# EasyEDA schematic SCH_clock rev b_2022-04-02.json
TITLE: Sheet_1; REV: B; Date: 2022-03-05; Sheet: 1/1; Drawn By: ckscullion; Company: Your Company
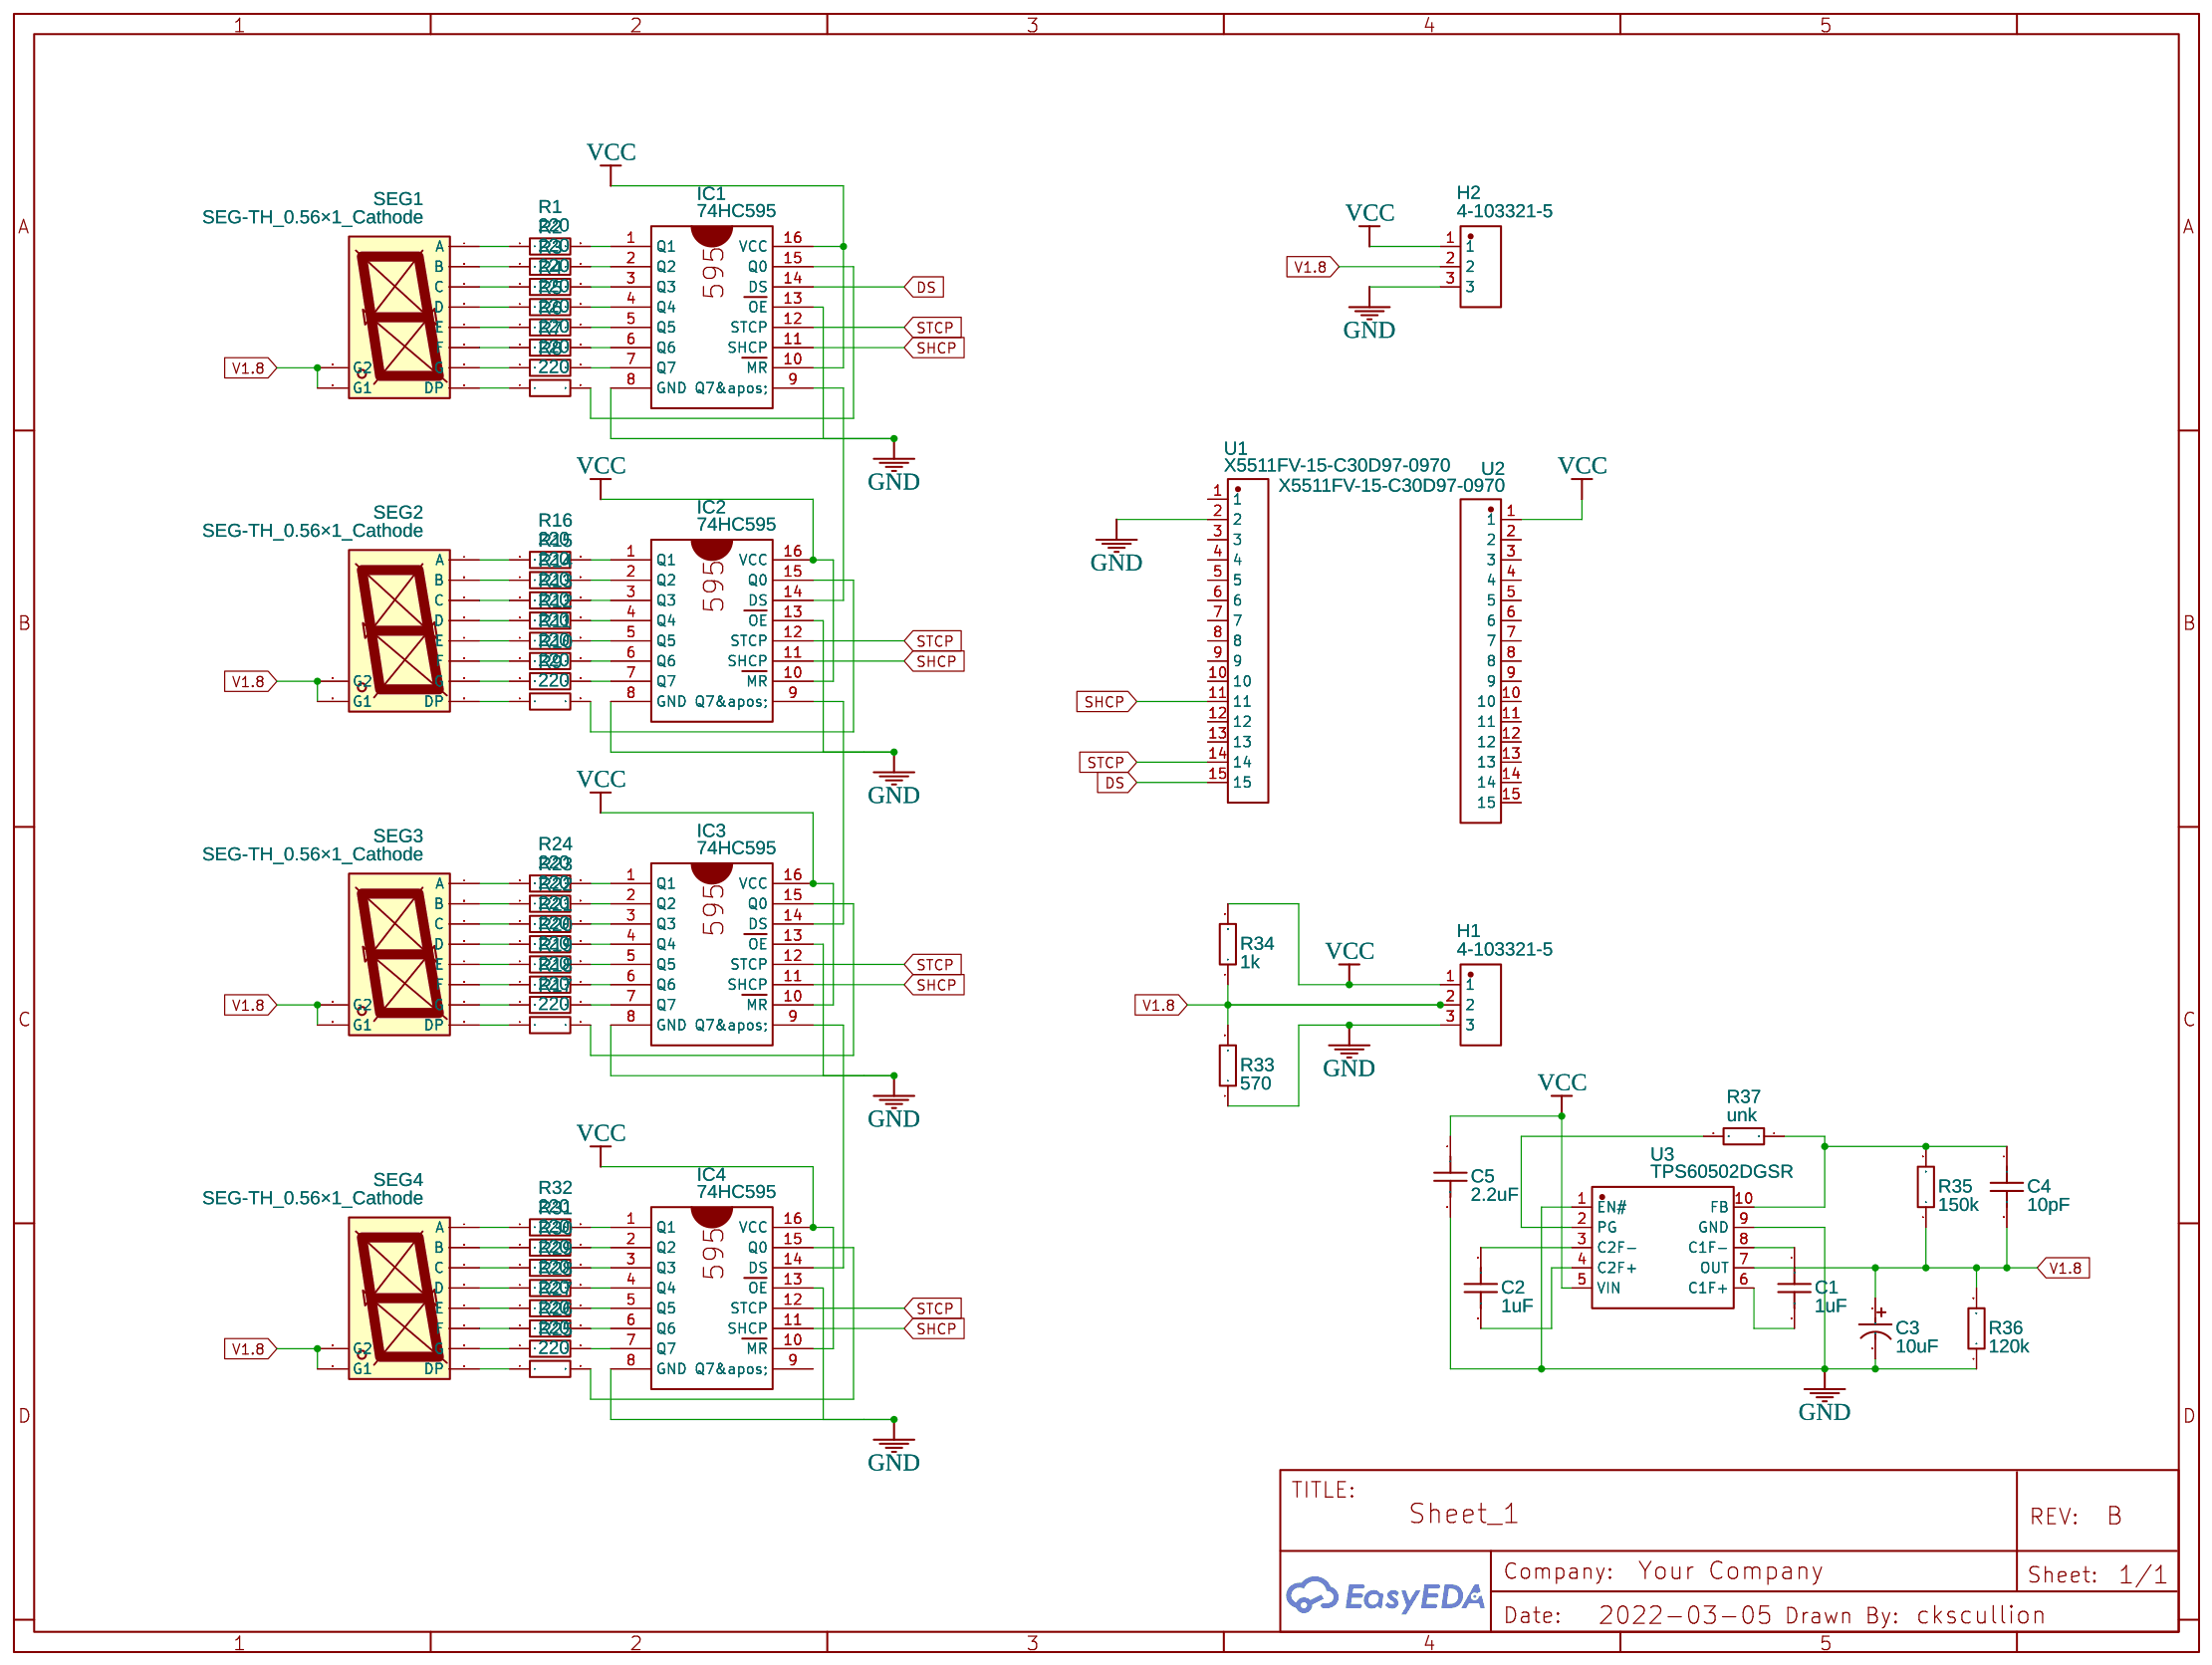
[diagram p0: schematic sheet]

## Parts
C1  1uF  [CAP-TH_L5.5-W3.5-P5.00-D1.2]
C2  1uF  [CAP-TH_L5.5-W3.5-P5.00-D1.2]
C3  10uF  [CAP-TH_BD5.0-P2.00-D0.8-FD]
C4  10pF  [CAP-TH_L5.5-W3.5-P5.00-D1.2]
C5  2.2uF  [CAP-TH_L5.5-W3.5-P5.00-D1.2]
H1  4-103321-5  [HDR-TH_3P-P2.54-V-M]
H2  4-103321-5  [HDR-TH_3P-P2.54-V-M]
IC1  74HC595  [74HC595]
IC2  74HC595  [74HC595]
IC3  74HC595  [74HC595]
IC4  74HC595  [74HC595]
R1  220  [RES-TH_BD3.3-L9.0-P13.00-D0.6]
R2  220  [RES-TH_BD3.3-L9.0-P13.00-D0.6]
R3  220  [RES-TH_BD3.3-L9.0-P13.00-D0.6]
R4  220  [RES-TH_BD3.3-L9.0-P13.00-D0.6]
R5  220  [RES-TH_BD3.3-L9.0-P13.00-D0.6]
R6  220  [RES-TH_BD3.3-L9.0-P13.00-D0.6]
R7  220  [RES-TH_BD3.3-L9.0-P13.00-D0.6]
R8  220  [RES-TH_BD3.3-L9.0-P13.00-D0.6]
R9  220  [RES-TH_BD3.3-L9.0-P13.00-D0.6]
R10  220  [RES-TH_BD3.3-L9.0-P13.00-D0.6]
R11  220  [RES-TH_BD3.3-L9.0-P13.00-D0.6]
R12  220  [RES-TH_BD3.3-L9.0-P13.00-D0.6]
R13  220  [RES-TH_BD3.3-L9.0-P13.00-D0.6]
R14  220  [RES-TH_BD3.3-L9.0-P13.00-D0.6]
R15  220  [RES-TH_BD3.3-L9.0-P13.00-D0.6]
R16  220  [RES-TH_BD3.3-L9.0-P13.00-D0.6]
R17  220  [RES-TH_BD3.3-L9.0-P13.00-D0.6]
R18  220  [RES-TH_BD3.3-L9.0-P13.00-D0.6]
R19  220  [RES-TH_BD3.3-L9.0-P13.00-D0.6]
R20  220  [RES-TH_BD3.3-L9.0-P13.00-D0.6]
R21  220  [RES-TH_BD3.3-L9.0-P13.00-D0.6]
R22  220  [RES-TH_BD3.3-L9.0-P13.00-D0.6]
R23  220  [RES-TH_BD3.3-L9.0-P13.00-D0.6]
R24  220  [RES-TH_BD3.3-L9.0-P13.00-D0.6]
R25  220  [RES-TH_BD3.3-L9.0-P13.00-D0.6]
R26  220  [RES-TH_BD3.3-L9.0-P13.00-D0.6]
R27  220  [RES-TH_BD3.3-L9.0-P13.00-D0.6]
R28  220  [RES-TH_BD3.3-L9.0-P13.00-D0.6]
R29  220  [RES-TH_BD3.3-L9.0-P13.00-D0.6]
R30  220  [RES-TH_BD3.3-L9.0-P13.00-D0.6]
R31  220  [RES-TH_BD3.3-L9.0-P13.00-D0.6]
R32  220  [RES-TH_BD3.3-L9.0-P13.00-D0.6]
R33  570  [RES-TH_BD3.3-L9.0-P13.00-D0.6]
R34  1k  [RES-TH_BD3.3-L9.0-P13.00-D0.6]
R35  150k  [RES-TH_BD3.3-L9.0-P13.00-D0.6]
R36  120k  [RES-TH_BD3.3-L9.0-P13.00-D0.6]
R37  unk  [RES-TH_BD3.3-L9.0-P13.00-D0.6]
SEG1  SEG-TH_0.56×1_Cathode  [LED-SEG-TH_10P-L12.6-W19.0-P2.54-S15.24-BL]
SEG2  SEG-TH_0.56×1_Cathode  [LED-SEG-TH_10P-L12.6-W19.0-P2.54-S15.24-BL]
SEG3  SEG-TH_0.56×1_Cathode  [LED-SEG-TH_10P-L12.6-W19.0-P2.54-S15.24-BL]
SEG4  SEG-TH_0.56×1_Cathode  [LED-SEG-TH_10P-L12.6-W19.0-P2.54-S15.24-BL]
U1  X5511FV-15-C30D97-0970  [HDR-TH_15P-P2.54-V-F]
U2  X5511FV-15-C30D97-0970  [HDR-TH_15P-P2.54-V-F]
U3  TPS60502DGSR  [VSSOP-10_L3.0-W3.0-P0.50-LS4.9-BL]

## Library data of the parts
C1 C2 C4 C5 = FK26X7R1H105KRE06: Supplier: LCSC; Supplier Part: C2839237; Manufacturer: TDK; Contributor: LCSC; JLCPCB Part Class: Extended Part
C3 = KF100M050C110A: Supplier: LCSC; Manufacturer: CapXon; Supplier Part: C59316; JLCPCB Part Class: Extended Part
H1 H2 = 4-103321-5: Supplier: LCSC; Supplier Part: C2895604; Manufacturer: TE Connectivity(美国泰科); Contributor: LCSC; JLCPCB Part Class: Extended Part
IC1-IC4 = 74HC595: Contributor: embeddedpcb2019
R1-R37 = MFR01SF2200A10: Supplier: LCSC; Manufacturer: UniOhm; Supplier Part: C58706; JLCPCB Part Class: Extended Part; Resistance: 220Ω
SEG1-SEG4 = SEG-TH_0.56×1_Cathode: Manufacturer: 志浩; Supplier Part: C8093; Contributor: LCEDA_01
U1 U2 = X5511FV-15-C30D97-0970: Supplier: LCSC; Supplier Part: C2883481; Manufacturer: XKB Connectivity(中国星坤); Contributor: LCSC
U3 = TPS60502DGSR: Supplier: LCSC; Supplier Part: C2071093; Manufacturer: TI(德州仪器); Contributor: LCSC; JLCPCB Part Class: Extended Part

## Nets
GND: C3.2 C5.2 H1.3 H2.3 IC1.8(GND) IC1.13(OE) IC2.8(GND) IC2.13(OE) IC3.8(GND) IC3.13(OE) IC4.8(GND) IC4.13(OE) R33.1 R36.1 U1.2 U3.1(EN#) U3.9(GND)
V1.8: C3.1 C4.2 H1.2 H2.2 R33.2 R34.1 R35.1 R36.2 SEG1.3(G1) SEG1.8(G2) SEG2.3(G1) SEG2.8(G2) SEG3.3(G1) SEG3.8(G2) SEG4.3(G1) SEG4.8(G2) U3.7(OUT)
VCC: C5.1 H1.1 H2.1 IC1.10(MR) IC1.16(VCC) IC2.10(MR) IC2.16(VCC) IC3.10(MR) IC3.16(VCC) IC4.10(MR) IC4.16(VCC) R34.2 U2.1 U3.5(VIN)
DS: IC1.14(DS) U1.15
SHCP: IC1.11(SHCP) IC2.11(SHCP) IC3.11(SHCP) IC4.11(SHCP) U1.11
STCP: IC1.12(STCP) IC2.12(STCP) IC3.12(STCP) IC4.12(STCP) U1.14
Net-(C1-1): C1.1 U3.8(C1F-)
Net-(C1-2): C1.2 U3.6(C1F+)
Net-(C2-1): C2.1 U3.3(C2F−)
Net-(C2-2): C2.2 U3.4(C2F+)
Net-(C4-1): C4.1 R35.2 R37.1 U3.10(FB)
Net-(IC1-1): IC1.1(Q1) R1.2
Net-(IC1-2): IC1.2(Q2) R2.2
Net-(IC1-3): IC1.3(Q3) R3.2
Net-(IC1-4): IC1.4(Q4) R4.2
Net-(IC1-5): IC1.5(Q5) R5.2
Net-(IC1-6): IC1.6(Q6) R6.2
Net-(IC1-7): IC1.7(Q7) R7.2
Net-(IC1-9): IC1.9(Q7') IC2.14(DS)
Net-(IC1-15): IC1.15(Q0) R8.2
Net-(IC2-1): IC2.1(Q1) R16.2
Net-(IC2-2): IC2.2(Q2) R15.2
Net-(IC2-3): IC2.3(Q3) R14.2
Net-(IC2-4): IC2.4(Q4) R13.2
Net-(IC2-5): IC2.5(Q5) R12.2
Net-(IC2-6): IC2.6(Q6) R11.2
Net-(IC2-7): IC2.7(Q7) R10.2
Net-(IC2-9): IC2.9(Q7') IC3.14(DS)
Net-(IC2-15): IC2.15(Q0) R9.2
Net-(IC3-1): IC3.1(Q1) R24.2
Net-(IC3-2): IC3.2(Q2) R23.2
Net-(IC3-3): IC3.3(Q3) R22.2
Net-(IC3-4): IC3.4(Q4) R21.2
Net-(IC3-5): IC3.5(Q5) R20.2
Net-(IC3-6): IC3.6(Q6) R19.2
Net-(IC3-7): IC3.7(Q7) R18.2
Net-(IC3-9): IC3.9(Q7') IC4.14(DS)
Net-(IC3-15): IC3.15(Q0) R17.2
Net-(IC4-1): IC4.1(Q1) R32.2
Net-(IC4-2): IC4.2(Q2) R31.2
Net-(IC4-3): IC4.3(Q3) R30.2
Net-(IC4-4): IC4.4(Q4) R29.2
Net-(IC4-5): IC4.5(Q5) R28.2
Net-(IC4-6): IC4.6(Q6) R27.2
Net-(IC4-7): IC4.7(Q7) R26.2
Net-(IC4-15): IC4.15(Q0) R25.2
Net-(R1-1): R1.1 SEG1.7(A)
Net-(R2-1): R2.1 SEG1.6(B)
Net-(R3-1): R3.1 SEG1.4(C)
Net-(R4-1): R4.1 SEG1.2(D)
Net-(R5-1): R5.1 SEG1.1(E)
Net-(R6-1): R6.1 SEG1.9(F)
Net-(R7-1): R7.1 SEG1.10(G)
Net-(R8-1): R8.1 SEG1.5(DP)
Net-(R9-1): R9.1 SEG2.5(DP)
Net-(R10-1): R10.1 SEG2.10(G)
Net-(R11-1): R11.1 SEG2.9(F)
Net-(R12-1): R12.1 SEG2.1(E)
Net-(R13-1): R13.1 SEG2.2(D)
Net-(R14-1): R14.1 SEG2.4(C)
Net-(R15-1): R15.1 SEG2.6(B)
Net-(R16-1): R16.1 SEG2.7(A)
Net-(R17-1): R17.1 SEG3.5(DP)
Net-(R18-1): R18.1 SEG3.10(G)
Net-(R19-1): R19.1 SEG3.9(F)
Net-(R20-1): R20.1 SEG3.1(E)
Net-(R21-1): R21.1 SEG3.2(D)
Net-(R22-1): R22.1 SEG3.4(C)
Net-(R23-1): R23.1 SEG3.6(B)
Net-(R24-1): R24.1 SEG3.7(A)
Net-(R25-1): R25.1 SEG4.5(DP)
Net-(R26-1): R26.1 SEG4.10(G)
Net-(R27-1): R27.1 SEG4.9(F)
Net-(R28-1): R28.1 SEG4.1(E)
Net-(R29-1): R29.1 SEG4.2(D)
Net-(R30-1): R30.1 SEG4.4(C)
Net-(R31-1): R31.1 SEG4.6(B)
Net-(R32-1): R32.1 SEG4.7(A)
Net-(R37-2): R37.2 U3.2(PG)

Not connected (* = marked no-connect by the designer): IC4 9(Q7'); U1 1 3 4 5 6 7 8 9 10 12 13; U2 2 3 4 5 6 7 8 9 10 11 12 13 14 15
